# Altium schematic sheet Soldering Tip (Opam).SchDoc: Opam
size A4; DrawnBy: Mauro De Bruyn; Revision: 1; SheetNumber: 4; SheetTotal: 5; Number: PXL EAI1_2
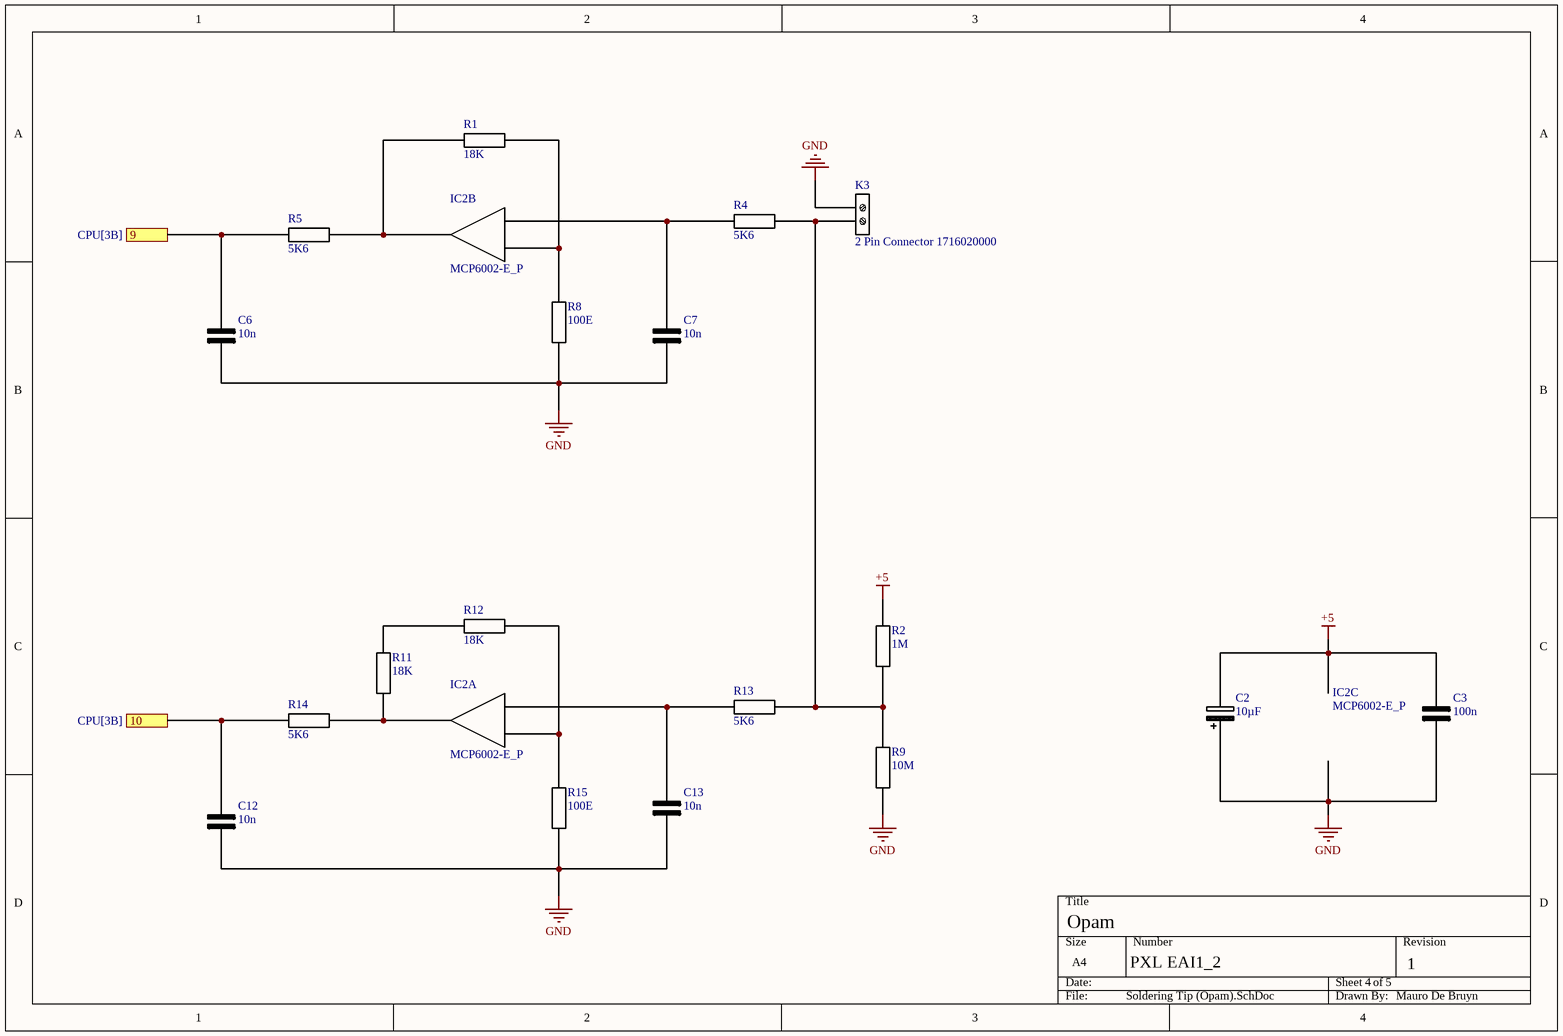
[diagram p0: Soldering Tip (Opam).SchDoc]

## Parts
C2  10µF  [CAPPRD200W52D500H1250]
C3  100n  [0805]
C6  10n  [0805]
C7  10n  [0805]
C12  10n  [0805]
C13  10n  [0805]
IC2  MCP6002-E_P  [DIP781W56P254L950H533Q8N]  (parts A,B,C of 3)
K3  2 Pin Connector 1716020000  [1716020000]
R1  18K  [0805]
R2  1M  [0805]
R4  5K6  [0805]
R5  5K6  [0805]
R8  100E  [0805]
R9  10M  [0805]
R11  18K  [0805]
R12  18K  [0805]
R13  5K6  [0805]
R14  5K6  [0805]
R15  100E  [0805]

## Ports
9 (see CPU[3B]), 10 (see CPU[3B])

## Nets
+5: C2.2(-) C3.2(-) IC2.8(VDD) R2.2
GND: C2.1(+) C3.1(+) C6.1(+) C7.1(+) C12.1(+) C13.1(+) IC2.4(VSS) K3.1 R8.1 R9.1 R15.1
9: C6.2(-) R5.1 ; port 9
10: C12.2(-) R14.1 ; port 10
NetC7_2: C7.2(-) IC2.5(VINB+) R4.1
NetC13_2: C13.2(-) IC2.3(VINA+) R13.1
NetIC2_1: IC2.1(VOUTA) R11.1 R14.2
NetIC2_2: IC2.2(VINA-) R12.1 R15.2
NetIC2_6: IC2.6(VINB-) R1.2 R8.2
NetIC2_7: IC2.7(VOUTB) R1.1 R5.2
NetK3_2: K3.2 R2.1 R4.2 R9.2 R13.2
NetR11_2: R11.2 R12.2

## Library data of the parts
C2 = 860020672010: Capacitor Polarised; Manufacturer_Name: Wurth Elektronik; Datasheet Link: https://componentsearchengine.com//860020672010.pdf; Height: 12.5mm; Mouser2 Part Number: 710-860020672010; Mouser2 Price/Stock: https://www.mouser.com/Search/Refine.aspx?Keyword=710-860020672010; Manufacturer_Part_Number: 860020672010
C3 C6 C7 C12 C13 = 0805 (Capacitor): Capacitor; Manufacturer_Name: Kemet; Manufacturer_Part_Number: C0805C391G3GACTU; Datasheet Link: https://content.kemet.com/datasheets/KEM_C1003_C0G_SMD.pdf; Height: 1.1mm
IC2 = MCP6002-E_P: Integrated Circuit; Manufacturer_Name: Microchip; Manufacturer_Part_Number: MCP6002-E/P; Datasheet Link: https://componentsearchengine.com//MCP6002-E_P.pdf; Height: 5.334mm; Mouser2 Part Number: 579-MCP6002-E/P; Mouser2 Price/Stock: https://www.mouser.com/Search/Refine.aspx?Keyword=579-MCP6002-E%2FP
K3 = 2 Pin Connector 1716020000: Connector; Manufacturer_Name: Weidmuller; Datasheet Link: https://catalog.weidmueller.com/catalog/Start.do?ObjectID=1716020000&_ga=2.21797499.1716783809.1613378202-511725545.1613378202; Manufacturer_Part_Number: 1716020000
R1 R2 R4 R5 R8 R9 R11-R15 = 0805 (Resistor): Resistor; Manufacturer_Name: Kemet; Manufacturer_Part_Number: C0805C391G3GACTU; Datasheet Link: https://content.kemet.com/datasheets/KEM_C1003_C0G_SMD.pdf; Height: 1.1mm